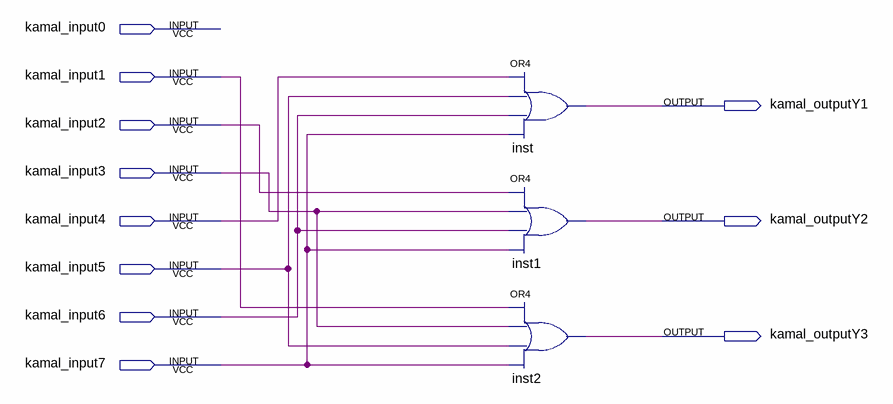
[diagram p0: schematic sheet]
// Quartus schematic kamal_lab1_8to3Encoder.bdf as structural Verilog: 3 symbols, 11 pins
module kamal_lab1_8to3Encoder (
  input  kamal_input0,
  input  kamal_input1,
  input  kamal_input2,
  input  kamal_input3,
  input  kamal_input4,
  input  kamal_input5,
  input  kamal_input6,
  input  kamal_input7,
  output kamal_outputY1,
  output kamal_outputY2,
  output kamal_outputY3
);

  or inst (kamal_outputY1, kamal_input4, kamal_input5, kamal_input6, kamal_input7);
  or inst1 (kamal_outputY2, kamal_input2, kamal_input3, kamal_input6, kamal_input7);
  or inst2 (kamal_outputY3, kamal_input1, kamal_input3, kamal_input5, kamal_input7);
endmodule
